# EasyEDA schematic ЧАТИКП v4.2.json
TITLE: ЧАТИКП; REV: 3.2; Date: 2022-11-17; Sheet: 1/1
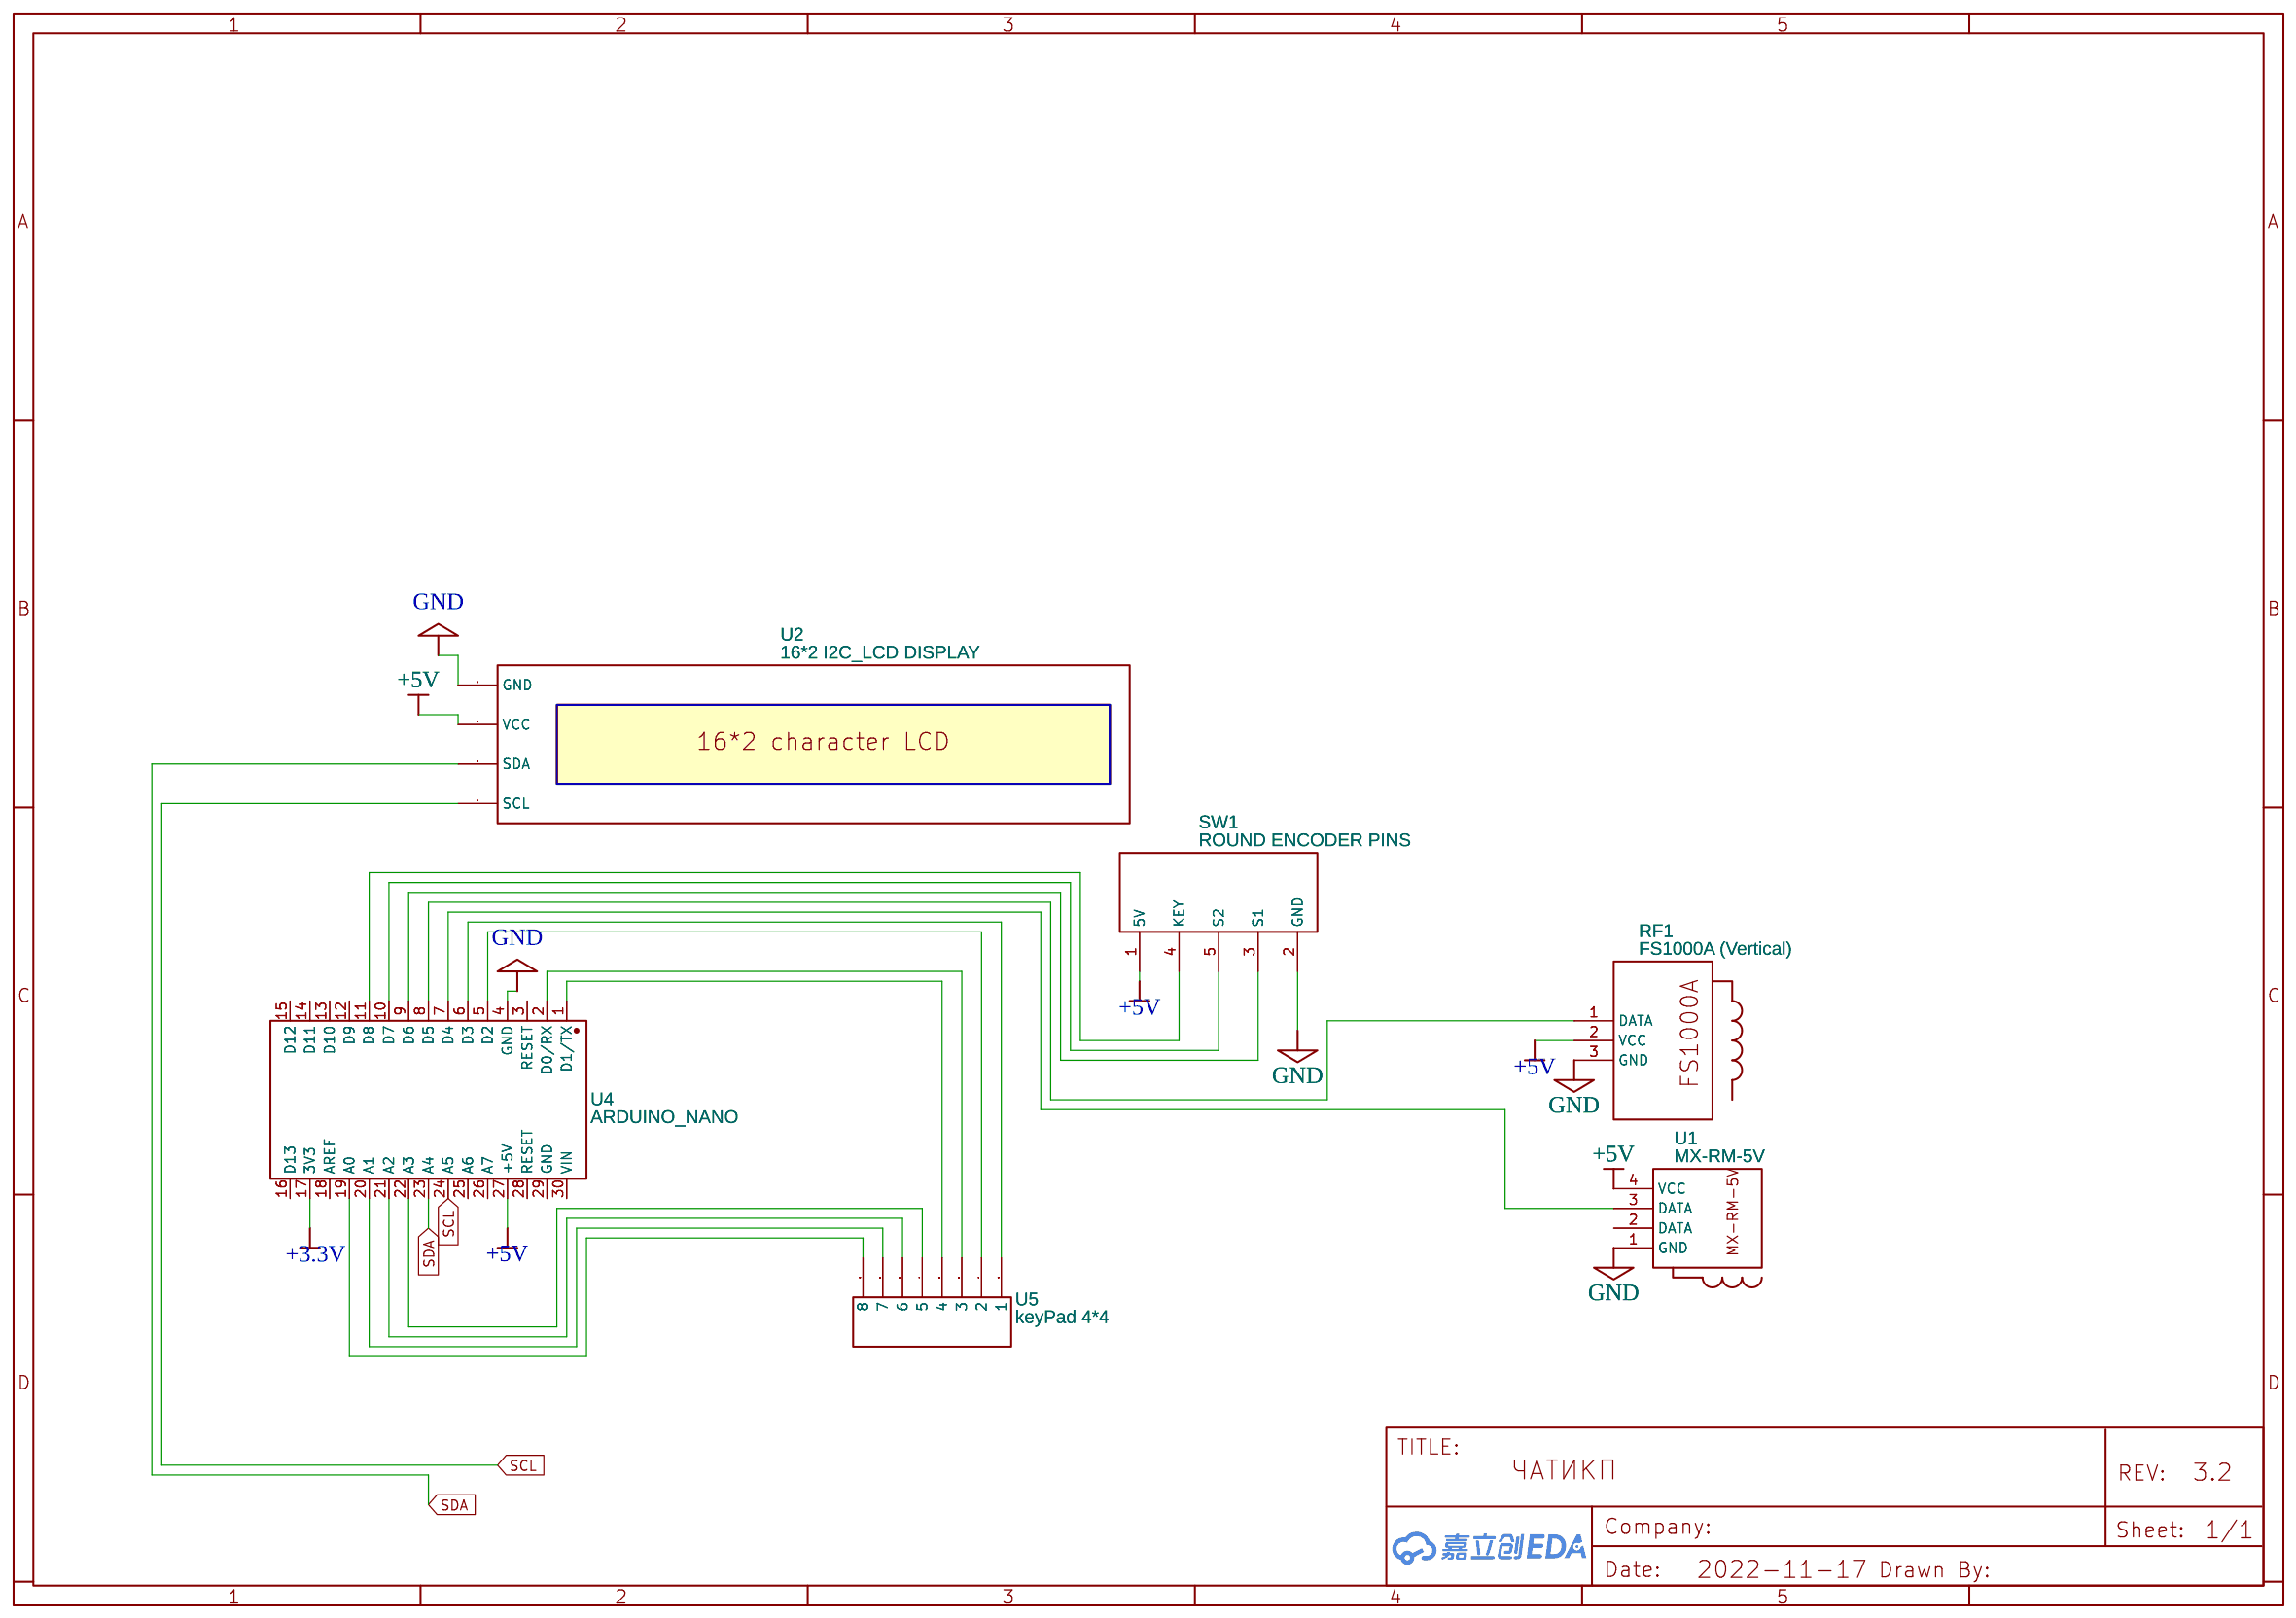
[diagram p0: schematic sheet]

## Parts
RF1  FS1000A (Vertical)  [FS1000A]
SW1  ROUND ENCODER PINS  [SW-TH_PEC11R-4XXXF-SXXXX]
U1  MX-RM-5V  [MX-RM-5V (VERTICAL)]
U2  16*2 I2C_LCD DISPLAY  [16*2_I2C_LCD DISPLAY]
U4  ARDUINO_NANO  [COMM-TH_ARDUINO_NANO]
U5  keyPad 4*4  [KEYPAD 4X4 (KEYPAD 4*4)]

## Library data of the parts
RF1 = FS1000A (Vertical): Contributor: kntznart
SW1 = ROUND ENCODER PINS: Supplier: LCSC; Supplier Part: C143789; Manufacturer: BOURNS; Manufacturer Part: PEC11R-4015F-S0024; Contributor: LCSC; LCSC Assembly: Yes; SMT Type: Extend
U1 = MX-RM-5V: Contributor: kntznart
U2 = 16*2 I2C_LCD DISPLAY: Supplier Part: undefined; Contributor: poppy0123
U4 = ARDUINO_NANO: Supplier: LCSC; Supplier Part: C9900017879; Manufacturer: null; JLCPCB Part Class: Extended Part; Contributor: lcsc
U5 = keyPad 4*4: Contributor: baanaan76182

## Nets
+3.3V: U4.17(3V3)
+5V: RF1.2(VCC) SW1.1(5V) U1.4(VCC) U2.2(VCC) U4.27(+5V)
GND: RF1.3(GND) SW1.2(GND) U1.1(GND) U2.1(GND) U4.4(GND)
SCL: U2.4(SCL) U4.24(A5)
SDA: U2.3(SDA) U4.23(A4)
Net-(RF1-1): RF1.1(DATA) U4.8(D5)
Net-(SW1-3): SW1.3(S1) U4.9(D6)
Net-(SW1-4): SW1.4(KEY) U4.11(D8)
Net-(SW1-5): SW1.5(S2) U4.10(D7)
Net-(U1-3): U1.3(DATA) U4.7(D4)
Net-(U4-1): U4.1(D1/TX) U5.6(4)
Net-(U4-2): U4.2(D0/RX) U5.5(3)
Net-(U4-5): U4.5(D2) U5.4(2)
Net-(U4-6): U4.6(D3) U5.3(1)
Net-(U4-19): U4.19(A0) U5.10(8)
Net-(U4-20): U4.20(A1) U5.9(7)
Net-(U4-21): U4.21(A2) U5.8(6)
Net-(U4-22): U4.22(A3) U5.7(5)

Not connected (* = marked no-connect by the designer): U1 2(DATA); U4 3(RESET) 12(D9) 13(D10) 14(D11) 15(D12) 16(D13) 18(AREF) 25(A6) 26(A7) 28(RESET) 29(GND) 30(VIN)
